# Altium schematic sheet Lesson_06_2.SchDoc
size A4
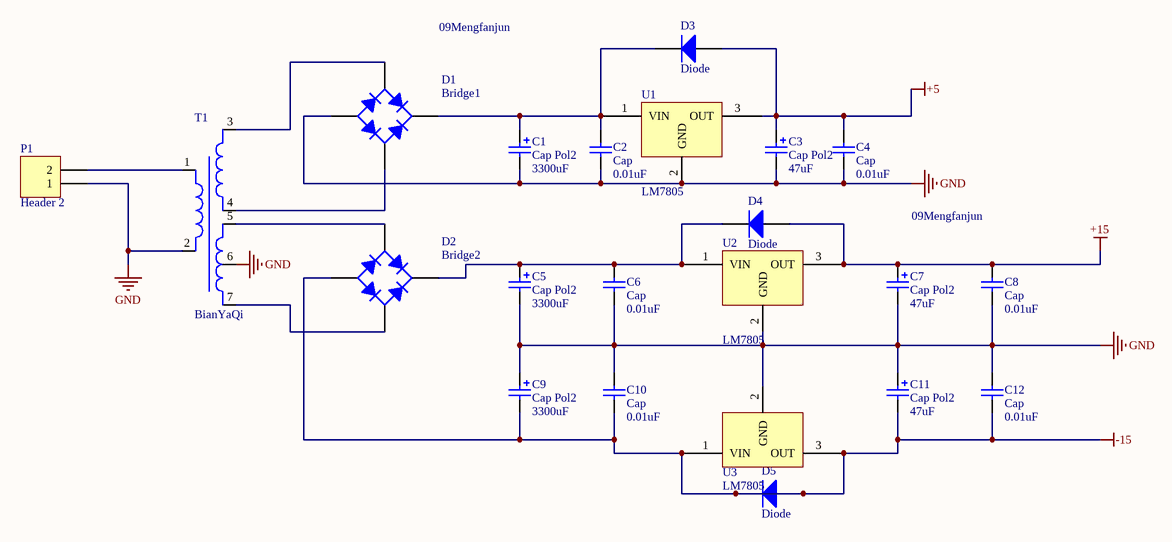
[diagram p0: Lesson_06_2.SchDoc]

## Parts
C1  Cap Pol2  value 3300uF  [POLAR0.8]
C2  Cap  value 0.01uF  [RAD-0.3]
C3  Cap Pol2  value 47uF  [POLAR0.8]
C4  Cap  value 0.01uF  [RAD-0.3]
C5  Cap Pol2  value 3300uF  [POLAR0.8]
C6  Cap  value 0.01uF  [RAD-0.3]
C7  Cap Pol2  value 47uF  [POLAR0.8]
C8  Cap  value 0.01uF  [RAD-0.3]
C9  Cap Pol2  value 3300uF  [POLAR0.8]
C10  Cap  value 0.01uF  [RAD-0.3]
C11  Cap Pol2  value 47uF  [POLAR0.8]
C12  Cap  value 0.01uF  [RAD-0.3]
D1  Bridge1  [D-38]
D2  Bridge2  [D-38]
D3  Diode  [SMC]
D4  Diode  [SMC]
D5  Diode  [SMC]
P1  Header 2  [HDR1X2]
T1  BianYaQi  [PCBComponent_1]
U1  LM7805  [LM7805]
U2  LM7805  [LM7805]
U3  LM7805  [LM7805]

## Nets
+5: C3.1 C4.2 D3.1(A) U1.3(OUT)
+15: C7.1 C8.2 D4.1(A) U2.3(OUT)
-15: C9.2 C10.1 C11.2 C12.1 D2.3(A) D5.1(A) D5.2(K) U3.1(VIN) U3.3(OUT)
GND: C1.2 C2.1 C3.2 C4.1 C5.2 C6.1 C7.2 C8.1 C9.1 C10.2 C11.1 C12.2 D1.3(A) P1.1 T1.2(Pri-) T1.6 U1.2(GND) U2.2(GND) U3.2(GND)
NetC1_1: C1.1 C2.2 D1.1(K) D3.2(K) U1.1(VIN)
NetC5_1: C5.1 C6.2 D2.1(K) D4.2(K) U2.1(VIN)
NetD1_2: D1.2(C) T1.4(Sec1-)
NetD1_4: D1.4(C) T1.3(Sec1+)
NetD2_2: D2.2(C) T1.7(Sec2-)
NetD2_4: D2.4(C) T1.5(Sec2+)
NetP1_2: P1.2 T1.1(Pri+)

## Notes on the sheet
- 09Mengfanjun

## Library data of the parts
C1 C3 C5 C7 C9 C11 = Cap Pol2: Polarized Capacitor (Axial); Published: 8-Jun-2000; LatestRevisionDate: 17-Jul-2002; LatestRevisionNote: Re-released for DXP Platform.; PackageReference: POLAR0.8; Publisher: Altium Limited; PackageDescription: Polarized Capacitor; 2 Leads
C2 C4 C6 C8 C10 C12 = Cap: Capacitor; Published: 8-Jun-2000; LatestRevisionDate: 17-Jul-2002; LatestRevisionNote: Re-released for DXP Platform.; PackageReference: RAD-0.3; Publisher: Altium Limited; PackageDescription: Radial Cap, Thru-Hole; 2 Leads; 0.3 in Pin Spacing
D1 D2 = Bridge1: Full Wave Diode Bridge; Published: 8-Jun-2000; LatestRevisionDate: 29-May-2009; LatestRevisionNote: Sch pins A & K swapped.; DatasheetVersion: E2732B; PackageReference: D-38; Publisher: Altium Limited; PackageDescription: Bridge Rectifier; 4 Terminals; Body 9.4 x 9.4 mm (typ); Pitch 5.08 mm
D3-D5 = Diode: Default Diode; Published: 8-Jun-2000; LatestRevisionDate: 17-Jul-2002; LatestRevisionNote: Re-released for DXP Platform.; PackageVersion: Sep-1996; PackageReference: SMC; Publisher: Altium Limited; PackageDescription: DO-214-AB/SMC; 2 C-Bend Leads; Body 7.9 x 5.9 mm, inc. leads (LxW); Code_JEDEC: DO-214-AB
P1 = Header 2: Header, 2-Pin; LatestRevisionDate: 17-Jul-2002; LatestRevisionNote: Re-released for DXP Platform.; Publisher: Altium Limited